# Altium schematic sheet MCU - 8266.SchDoc: MicroLedController
size A4; DrawnBy: Sindre Boi; Revision: V1; SheetNumber: 1
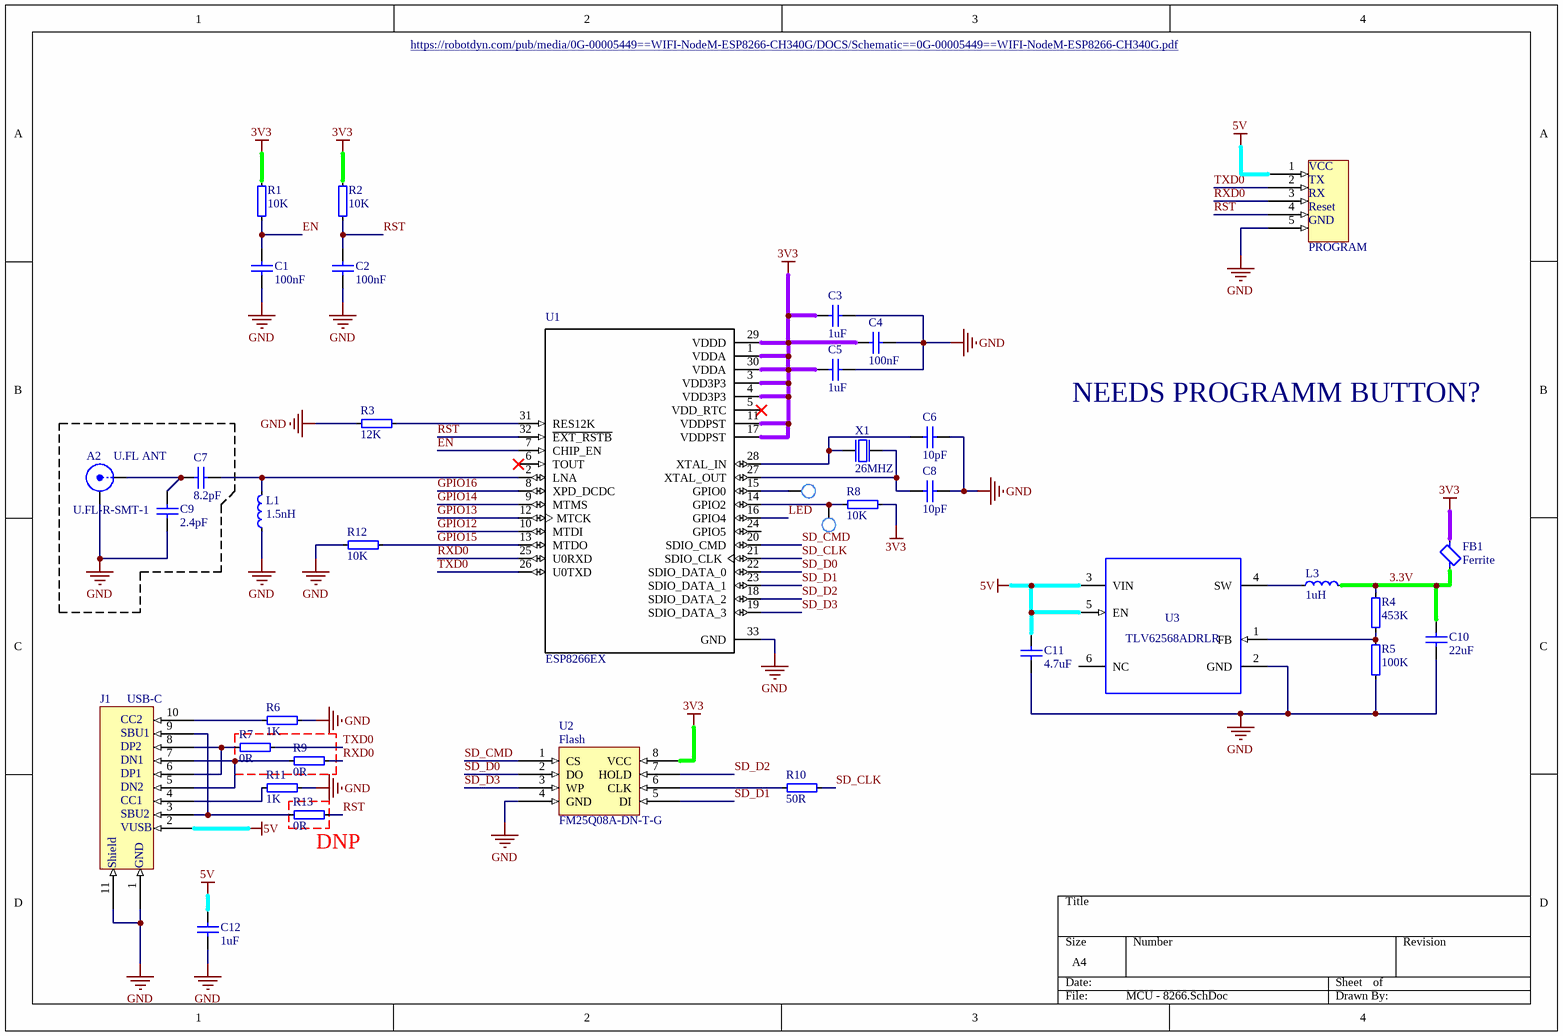
[diagram p0: MCU - 8266.SchDoc]

## Parts
A2  U.FL-R-SMT-1  [COAXIAL RF U.FL-R-SMT-1]
C1  100nF  [C0603]
C2  100nF  [C0603]
C3  1uF  [C0603]
C4  100nF  [C0603]
C5  1uF  [C0603]
C6  10pF  [C0603]
C7  8.2pF  [CAPC1608X06L]
C8  10pF  [C0603]
C9  2.4pF  [CAPC1608X06L]
C10  22uF  [C0603]
C11  4.7uF  [C0603]
C12  1uF  [C0603]
FB1  Ferrite  [IND0603]
GPIO0  TP  [TP_SMD_Ø1.0mm]  (value not drawn)
GPIO2  TP  [TP_SMD_Ø1.0mm]  (value not drawn)
J1  USB-C  [TYPE-C-31-M-12]
L1  1.5nH  [IND0603]
L3  1uH  [IND0603]
PROGRAM  Programmer  [ProgramPins]  (value not drawn)
R1  10K  [RES0603R]
R2  10K  [RES0603R]
R3  12K  [RES0603R]
R4  453K  [RES0603R]
R5  100K  [RES0603R]
R6  1K  [RES0603R]
R7  0R  [RES0603R]
R8  10K  [RES0603R]
R9  0R  [RES0603R]
R10  50R  [RES0603R]
R11  1K  [RES0603R]
R12  10K  [RES0603R]
R13  0R  [RES0603R]
U1  ESP8266EX  [*QFN50P500X500X80-33N]
U2  FM25Q08A-DN-T-G  [FM25Q08A]
U3  TLV62568ADRLR  [DRL0006A]
X1  26MHZ  [BT-XTAL_2016]

## Blocks framed on the sheet
U.FL ANT: A2 C7 C9

## Nets
3V3: C3.2 C4.2 C5.2 FB1.1 R1.2 R2.2 R8.2 U1.1(VDDA) U1.3(VDD3P3) U1.4(VDD3P3) U1.11(VDDPST) U1.17(VDDPST) U1.29(VDDD) U1.30(VDDA) U2.8(VCC)
5V: C11.2 C12.2 J1.2 PROGRAM.1 U3.3(VIN) U3.5(EN)
GND: A2.2(Y) C1.1 C2.1 C3.1 C4.1 C5.1 C6.1 C8.1 C9.1 C10.1 C11.1 C12.1 J1.1 J1.11 L1.1 PROGRAM.5 R3.1 R5.1 R6.2 R11.2 R12.1 U1.33(GND) U2.4(GND) U3.2(GND) X1.2(GND) X1.4(GND)
3.3V: C10.2 FB1.2 L3.2 R4.2
EN: C1.2 R1.1 U1.7(CHIP_EN)
GPIO12: U1.10(MTDI)
GPIO13: U1.12(MTCK)
GPIO14: U1.9(MTMS)
GPIO15: R12.2 U1.13(MTDO)
GPIO16: U1.8(XPD_DCDC)
LED: U1.16(GPIO4)
RST: C2.2 PROGRAM.4 R2.1 R13.2 U1.32(~{EXT_RSTB})
RXD0: PROGRAM.3 R9.2 U1.25(U0RXD)
SD_CLK: R10.2 U1.21(SDIO_CLK)
SD_CMD: U1.20(SDIO_CMD) U2.1(CS)
SD_D0: U1.22(SDIO_DATA_0) U2.2(DO)
SD_D1: U1.23(SDIO_DATA_1) U2.5(DI)
SD_D2: U1.18(SDIO_DATA_2) U2.7(HOLD)
SD_D3: U1.19(SDIO_DATA_3) U2.3(WP)
TXD0: PROGRAM.2 R7.2 U1.26(U0TXD)
NetA2_1: A2.1(X) C7.2 C9.2
NetC6_2: C6.2 U1.28(XTAL_IN) X1.3(out)
NetC7_1: C7.1 L1.2 U1.2(LNA)
NetC8_2: C8.2 U1.27(XTAL_OUT) X1.1(inp)
NetGPIO0_1: GPIO0.1 U1.15(GPIO0)
NetGPIO2_1: GPIO2.1 R8.1 U1.14(GPIO2)
NetJ1_3: J1.3 J1.9 R13.1
NetJ1_4: J1.4 R11.1
NetJ1_5: J1.5 J1.7 R9.1
NetJ1_6: J1.6 J1.8 R7.1
NetJ1_10: J1.10 R6.1
NetL3_1: L3.1 U3.4(SW)
NetR3_2: R3.2 U1.31(RES12K)
NetR4_1: R4.1 R5.2 U3.1(FB)
NetR10_1: R10.1 U2.6(CLK)

Not connected (* = marked no-connect by the designer): U1 5(VDD_RTC)* 6(TOUT)* 24(GPIO5); U3 6(NC)

## Notes on the sheet
- https://robotdyn.com/pub/media/0G-00005449==WIFI-NodeM-ESP8266-CH340G/DOCS/Schematic==0G-00005449==WIFI-NodeM-ESP8266-CH340G.pdf
- NEEDS PROGRAMM BUTTON?
- (near R13) DNP
- (in symbol Programmer) VCC; TX; RX; Reset; GND
- (in symbol USB-C) CC2; SBU1; DP2; DN1; DP1; DN2; CC1; SBU2; VUSB; Shield; GND

## Library data of the parts
A2 = SMA: ONN U.FL RCPT STR 50 OHM SMD; Manufacturer: Hirose Electric Co Ltd; Artikkelnr Noca: N.A.; Part Number: U.FL-R-SMT-1; Manufacturer Part Number: U.FL-R-SMT-1; ComponentLink1URL: https://media.digikey.com/pdf/Data%20Sheets/Hirose%20PDFs/UFL%20Series.pdf; ComponentLink1Description: Datasheet; ComponentLink2URL: *; ComponentLink2Description: Supplier link; HelpURL: *; Footprint Doc: COAXIAL RF U.FL-R-SMT-1; LatestRevisionDate: 2018-05-07; Pin Count: 3; Publisher: Nordic Semiconductor; Published: 2018-05-07; Value: U.FL-R-SMT-1; Note: *; Supplier 1: Digi-Key; Supplier Part Number 1: H11891DKR-ND; Supplier 2: *; Supplier Part Number 2: *; Part number IPS: N.A.
C1-C12 = CAP: Capacitor; Value: 100pF; Published: 8-Jun-2000; Revision: July-2002: Re-released for DXP Platform.; Publisher: Altium Limited
FB1 = FerrideBead: Ferrite Bead, 120 Ohm @ 100MHz, 500mA, 250 mOhm Max; Part Number: FB0402-120R@100M-500mA; Manufacturer: Murata; Manufacturer Part Number: BLM15AG121SN1D; Part number IPS: N.A.; Value: 120R/0.55A; Note: Chip EMIFIL Inductor Type Chip Ferrite Bead; Artikkelnr Noca: 33029317; Footprint Doc: 0402; LatestRevisionDate: 2014-01-10; Pin Count: 2; Publisher: Nordic Semiconductor; Published: 2011-11-14; ComponentLink1URL: *; ComponentLink1Description: Datasheet; ComponentLink2URL: *; ComponentLink2Description: Supplier link; HelpURL: http://search.murata.co.jp/Ceramy/image/img/PDF/ENG/L0110S0100BLM15A_SN.pdf; Supplier 1: Digi-Key; Supplier Part Number 1: 490-1005-1-ND; Supplier 2: Farnell; Supplier Part Number 2: 151-5760
L1 L3 = IND: Inductor; Part Number: FB0402-120R@100M-500mA; Manufacturer: Murata; Manufacturer Part Number: BLM15AG121SN1D; Part number IPS: N.A.; Value: 120R/0.55A; Note: Chip EMIFIL Inductor Type Chip Ferrite Bead; Artikkelnr Noca: 33029317; Footprint Doc: 0402; LatestRevisionDate: 2014-01-10; Pin Count: 2; Publisher: Nordic Semiconductor; Published: 2011-11-14; ComponentLink1URL: *; ComponentLink1Description: Datasheet; ComponentLink2URL: *; ComponentLink2Description: Supplier link; HelpURL: http://search.murata.co.jp/Ceramy/image/img/PDF/ENG/L0110S0100BLM15A_SN.pdf; Supplier 1: Digi-Key; Supplier Part Number 1: 490-1005-1-ND; Supplier 2: Farnell; Supplier Part Number 2: 151-5760
PROGRAM = Programmer: Programmer header
R1-R6 R8 R10-R12 = RES: Resistor, ±5%, 0.05W; Part Number: R0201-0R; Part number IPS: 00000003245; Value: 0R; Note: Chip Res 5%; Artikkelnr Noca: N.A.; Manufacturer: *; Manufacturer Part Number: *; ComponentLink1URL: *; ComponentLink1Description: Datasheet; ComponentLink2URL: *; ComponentLink2Description: Supplier link; HelpURL: *; Footprint Doc: 0201; LatestRevisionDate: 2017-11-09; Pin Count: 2; Publisher: Nordic Semiconductor; Published: 2014-11-13; Supplier 1: *; Supplier Part Number 1: *; Supplier 2: *; Supplier Part Number 2: *
R7 R9 R13 = RES: Resistor, ±5%, 0.05W; Part Number: R0201-0R; Part number IPS: 00000003245; Note: Chip Res 5%; Artikkelnr Noca: N.A.; Manufacturer: *; Manufacturer Part Number: *; ComponentLink1URL: *; ComponentLink1Description: Datasheet; ComponentLink2URL: *; ComponentLink2Description: Supplier link; HelpURL: *; Footprint Doc: 0201; LatestRevisionDate: 2017-11-09; Pin Count: 2; Publisher: Nordic Semiconductor; Published: 2014-11-13; Value: 0R; Supplier 1: *; Supplier Part Number 1: *; Supplier 2: *; Supplier Part Number 2: *
U1 = ESP8266EX: MF: Espressif Systems; SnapEDA_Link: https://www.snapeda.com/parts/ESP8266EX/Espressif%20Systems/view-part/555861/?ref=snap; Price: None; Package: VFQFN-32 Espressif Systems; Availability: Unavailable; MP: ESP8266EX; Value: *
U2 = Flash: FM25Q08A-DN-T-G, 8Mb flash, compadable with  FM25W02-SN-T-G, 2Mb flash
U3 = TLV62568ADRLR: Manufacturer Name: Texas Instruments; PackageReference: TLV62568ADRLR; Manufacturer Part Number: TLV62568ADRLR; Value: N/A
X1 = XTAL_4-pin_grounded: X201626MOD4SI; Part Number: XTAL_SMD2016_32MHz_8pF_Golledge; Manufacturer: Golledge; Manufacturer Part Number: MP06003; Part number IPS: N.A.; Value: 32MHz; Note: XTAL SMD 32.000MHz; Artikkelnr Noca: 22010050; LatestRevisionDate: 2016-11-02; Pin Count: 4; Publisher: Nordic Semiconductor; Published: 2016-11-02; Footprint Doc: XTAL_2016; ComponentLink1URL: *; ComponentLink1Description: Datasheet; ComponentLink2URL: *; ComponentLink2Description: Supplier link; HelpURL: \\hizz\pro\app9717\Datasheet\crystals\Golledge\mp06003.pdf; Supplier 1: Link Nordic; Supplier Part Number 1: *; Supplier 2: *; Supplier Part Number 2: *